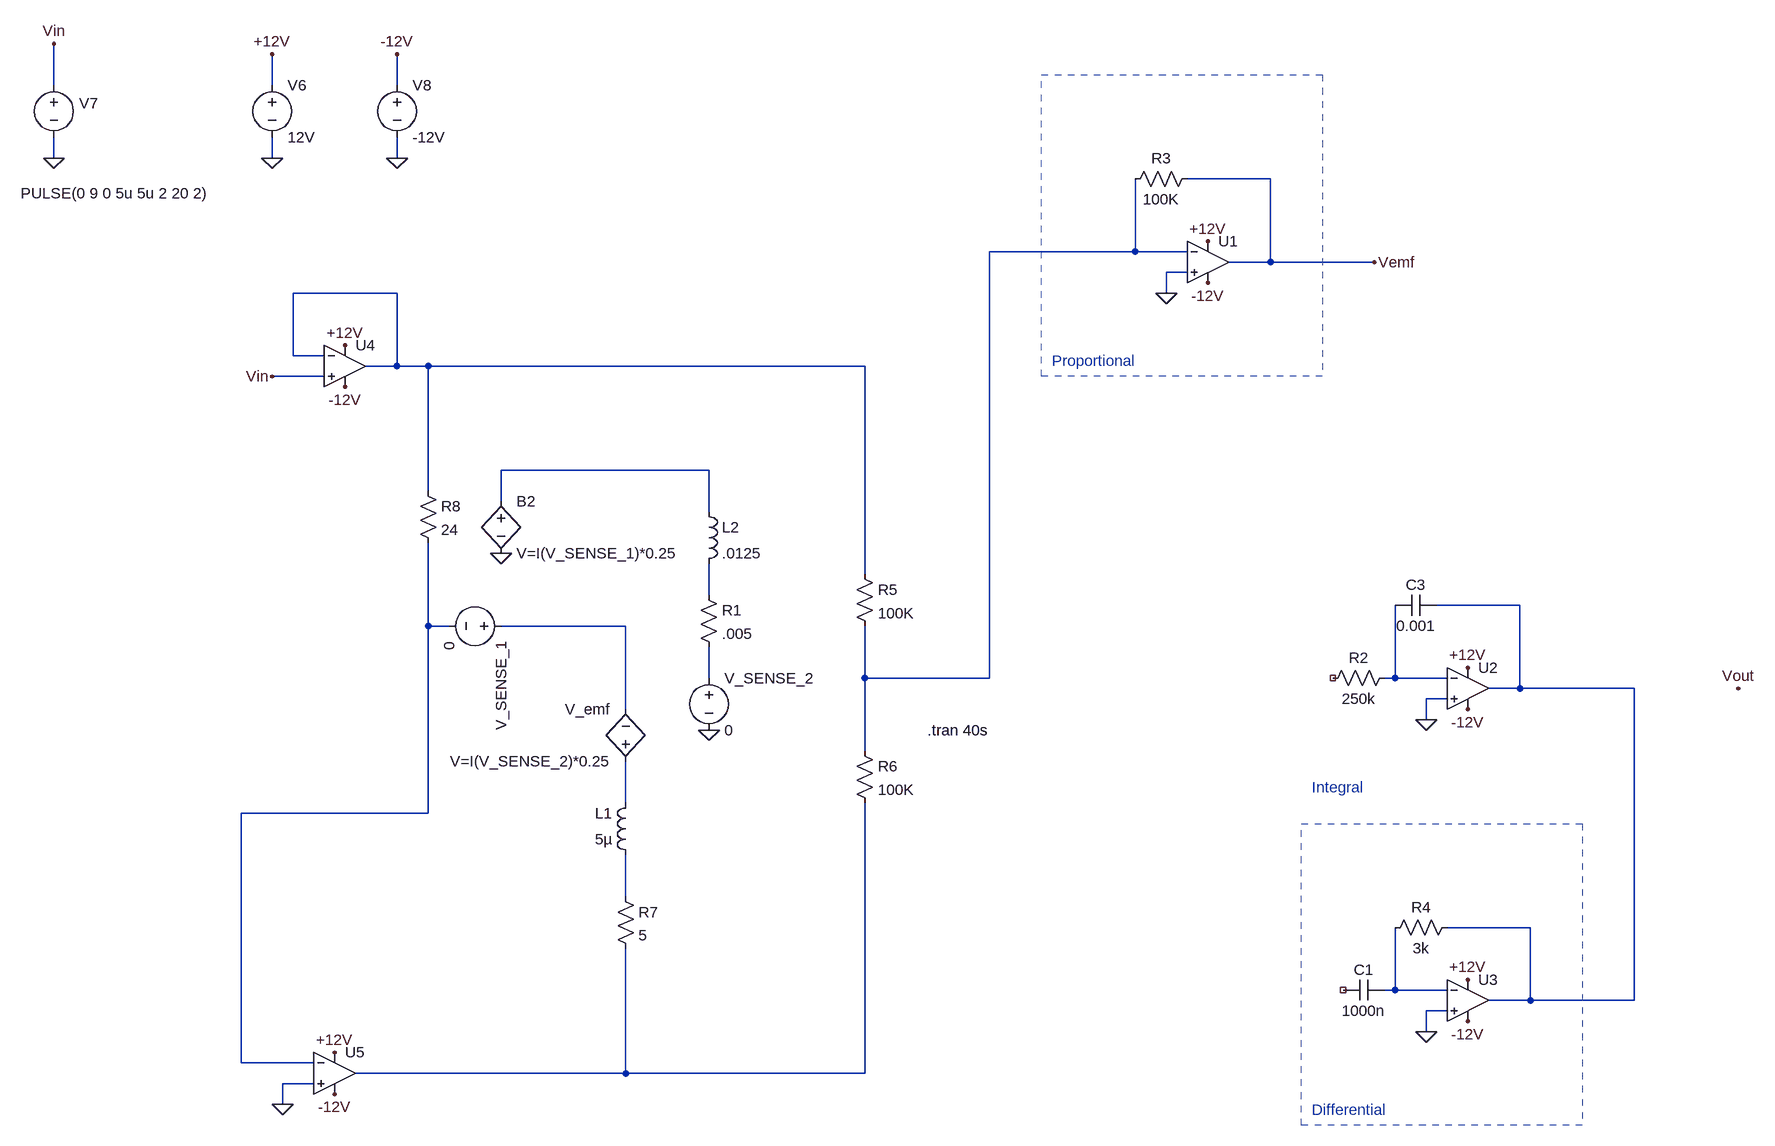
[diagram p0: schematic PID_parallel_opamps.asc]
PID_parallel_opamps.asc, the LTspice schematic file:
Version 4
SHEET 1 988 1060
WIRE -1648 -592 -1648 -656
WIRE -1312 -592 -1312 -640
WIRE -1120 -592 -1120 -640
WIRE -1648 -480 -1648 -512
WIRE -1312 -480 -1312 -512
WIRE -1120 -480 -1120 -512
WIRE 224 -448 96 -448
WIRE 16 -336 16 -448
WIRE 16 -336 -208 -336
WIRE 96 -336 16 -336
WIRE 224 -320 224 -448
WIRE 224 -320 160 -320
WIRE 384 -320 224 -320
WIRE 96 -304 64 -304
WIRE -1120 -272 -1280 -272
WIRE 64 -272 64 -304
WIRE -1280 -176 -1280 -272
WIRE -1232 -176 -1280 -176
WIRE -1120 -160 -1120 -272
WIRE -1120 -160 -1168 -160
WIRE -1072 -160 -1120 -160
WIRE -400 -160 -1072 -160
WIRE -1232 -144 -1312 -144
WIRE -640 0 -960 0
WIRE -1072 32 -1072 -160
WIRE -960 48 -960 0
WIRE -640 64 -640 0
WIRE -400 160 -400 -160
WIRE -640 192 -640 144
WIRE 608 208 480 208
WIRE -1072 240 -1072 112
WIRE -1040 240 -1072 240
WIRE -768 240 -960 240
WIRE -640 320 -640 272
WIRE -400 320 -400 240
WIRE -208 320 -208 -336
WIRE -208 320 -400 320
WIRE 416 320 416 208
WIRE 416 320 400 320
WIRE 496 320 416 320
WIRE 608 336 608 208
WIRE 608 336 560 336
WIRE 784 336 608 336
WIRE 496 352 464 352
WIRE -768 368 -768 240
WIRE 464 384 464 352
WIRE -400 432 -400 320
WIRE -768 512 -768 448
WIRE -1072 528 -1072 240
WIRE -1072 528 -1360 528
WIRE -768 656 -768 592
WIRE 624 704 496 704
WIRE 416 800 416 704
WIRE 416 800 400 800
WIRE 496 800 416 800
WIRE 624 816 624 704
WIRE 624 816 560 816
WIRE 784 816 784 336
WIRE 784 816 624 816
WIRE 496 832 464 832
WIRE 464 864 464 832
WIRE -1360 912 -1360 528
WIRE -1248 912 -1360 912
WIRE -768 928 -768 736
WIRE -768 928 -1184 928
WIRE -400 928 -400 512
WIRE -400 928 -768 928
WIRE -1248 944 -1296 944
WIRE -1296 976 -1296 944
FLAG 64 -272 0
FLAG 464 384 0
FLAG 464 864 0
FLAG -1648 -480 0
FLAG 944 336 Vout
FLAG -1648 -656 Vin
FLAG -1312 -480 0
FLAG -1120 -480 0
FLAG -1312 -640 +12V
FLAG -1120 -640 -12V
FLAG 128 -352 +12V
FLAG 528 304 +12V
FLAG 528 368 -12V
FLAG 128 -288 -12V
FLAG 528 848 -12V
FLAG 528 784 +12V
FLAG -1200 -192 +12V
FLAG -1216 896 +12V
FLAG -1200 -128 -12V
FLAG -1216 960 -12V
FLAG -1312 -144 Vin
FLAG -1296 976 0
FLAG 384 -320 Vemf
FLAG -640 400 0
FLAG -960 128 0
SYMBOL Opamps\\UniversalOpamp2 128 -320 R0
SYMATTR InstName U1
SYMBOL Opamps\\UniversalOpamp2 528 336 R0
SYMATTR InstName U2
SYMBOL Opamps\\UniversalOpamp2 528 816 R0
SYMATTR InstName U3
SYMBOL res 416 304 R90
WINDOW 0 0 56 VBottom 2
WINDOW 3 32 56 VTop 2
SYMATTR InstName R2
SYMATTR Value 250k
SYMBOL res 112 -464 R90
WINDOW 0 0 56 VBottom 2
WINDOW 3 32 56 VTop 2
SYMATTR InstName R3
SYMATTR Value 100K
SYMBOL cap 400 784 R90
WINDOW 0 0 32 VBottom 2
WINDOW 3 32 32 VTop 2
SYMATTR InstName C1
SYMATTR Value 1000n
SYMBOL cap 480 192 R90
WINDOW 0 0 32 VBottom 2
WINDOW 3 32 32 VTop 2
SYMATTR InstName C3
SYMATTR Value 0.001
SYMBOL res 512 688 R90
WINDOW 0 0 56 VBottom 2
WINDOW 3 32 56 VTop 2
SYMATTR InstName R4
SYMATTR Value 3k
SYMBOL voltage -1648 -608 R0
WINDOW 0 39 44 Left 2
WINDOW 3 -51 182 Left 2
WINDOW 123 0 0 Left 0
WINDOW 39 0 0 Left 0
SYMATTR InstName V7
SYMATTR Value PULSE(0 9 0 5u 5u 2 20 2)
SYMBOL Opamps\\UniversalOpamp2 -1200 -160 R0
SYMATTR InstName U4
SYMBOL Opamps\\UniversalOpamp2 -1216 928 R0
SYMATTR InstName U5
SYMBOL voltage -1312 -608 R0
WINDOW 123 0 0 Left 0
WINDOW 39 0 0 Left 0
SYMATTR InstName V6
SYMATTR Value 12V
SYMBOL voltage -1120 -608 R0
WINDOW 123 0 0 Left 0
WINDOW 39 0 0 Left 0
SYMATTR InstName V8
SYMATTR Value -12V
SYMBOL res -416 144 R0
SYMATTR InstName R5
SYMATTR Value 100K
SYMBOL res -416 416 R0
SYMATTR InstName R6
SYMATTR Value 100K
SYMBOL ind -752 608 R180
WINDOW 0 36 80 Left 2
WINDOW 3 36 40 Left 2
SYMATTR InstName L1
SYMATTR Value 5µ
SYMBOL res -784 640 R0
SYMATTR InstName R7
SYMATTR Value 5
SYMBOL res -1088 16 R0
SYMATTR InstName R8
SYMATTR Value 24
SYMBOL bv -768 464 R180
WINDOW 0 24 96 Left 2
WINDOW 3 24 16 Left 2
SYMATTR InstName V_emf
SYMATTR Value V=I(V_SENSE_2)*0.25
SYMBOL voltage -944 240 R90
WINDOW 123 0 0 Left 0
WINDOW 39 0 0 Left 0
SYMATTR InstName V_SENSE_1
SYMATTR Value 0
SYMBOL bv -960 32 R0
SYMATTR InstName B2
SYMATTR Value V=I(V_SENSE_1)*0.25
SYMBOL ind -656 48 R0
SYMATTR InstName L2
SYMATTR Value .0125
SYMBOL res -656 176 R0
SYMATTR InstName R1
SYMATTR Value .005
SYMBOL voltage -640 304 R0
WINDOW 123 0 0 Left 0
WINDOW 39 0 0 Left 0
SYMATTR InstName V_SENSE_2
SYMATTR Value 0
TEXT -304 400 Left 2 !.tran 40s
TEXT -112 -168 Left 2 ;Proportional
TEXT 288 488 Left 2 ;Integral
TEXT 288 984 Left 2 ;Differential
RECTANGLE Normal 304 -144 -128 -608 2
RECTANGLE Normal 704 1008 272 544 2

The netlist it stands for:
* PID_parallel_opamps.asc
XU1 0 N001 +12V -12V Vemf level.2 Avol=1Meg GBW=10Meg Slew=10Meg ilimit=25m rail=0 Vos=0 phimargin=45 en=0 enk=0 in=0 ink=0 Rin=500Meg  ; pins IN+ IN- V+ V- OUT
XU2 0 N009 +12V -12V N005 level.2 Avol=1Meg GBW=10Meg Slew=10Meg ilimit=25m rail=0 Vos=0 phimargin=45 en=0 enk=0 in=0 ink=0 Rin=500Meg  ; pins IN+ IN- V+ V- OUT
XU3 0 N012 +12V -12V N005 level.2 Avol=1Meg GBW=10Meg Slew=10Meg ilimit=25m rail=0 Vos=0 phimargin=45 en=0 enk=0 in=0 ink=0 Rin=500Meg  ; pins IN+ IN- V+ V- OUT
R2 N009 NC_01 250k
R3 Vemf N001 100K
C1 N012 NC_02 1000n
C3 N005 N009 0.001
R4 N005 N012 3k
V7 Vin 0 PULSE(0 9 0 5u 5u 2 20 2)
XU4 Vin N002 +12V -12V N002 level.2 Avol=1Meg GBW=10Meg Slew=10Meg ilimit=25m rail=0 Vos=0 phimargin=45 en=0 enk=0 in=0 ink=0 Rin=500Meg  ; pins IN+ IN- V+ V- OUT
XU5 0 N006 +12V -12V N013 level.2 Avol=1Meg GBW=10Meg Slew=10Meg ilimit=25m rail=0 Vos=0 phimargin=45 en=0 enk=0 in=0 ink=0 Rin=500Meg  ; pins IN+ IN- V+ V- OUT
V6 +12V 0 12V
V8 -12V 0 -12V
R5 N002 N001 100K
R6 N001 N013 100K
L1 N011 N010 5µ
R7 N011 N013 5
R8 N002 N006 24
B§V_emf N010 N007 V=I(V_SENSE_2)*0.25
V_SENSE_1 N007 N006 0
B2 N003 0 V=I(V_SENSE_1)*0.25
L2 N003 N004 .0125
R1 N004 N008 .005
V_SENSE_2 N008 0 0
.tran 40s
* Proportional
* Integral
* Differential
.lib UniversalOpamps2.sub
.backanno
.end